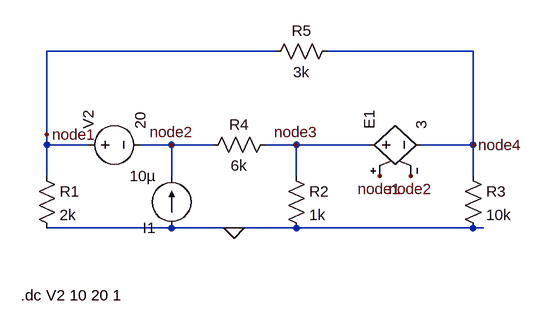
[diagram p0: schematic 2.asc]
2.asc, the LTspice schematic file:
Version 4
SHEET 1 880 680
WIRE 208 32 -144 32
WIRE 512 32 288 32
WIRE -144 160 -144 32
WIRE -144 176 -144 160
WIRE -80 176 -144 176
WIRE 48 176 0 176
WIRE 112 176 48 176
WIRE 240 176 192 176
WIRE 352 176 240 176
WIRE 512 176 512 32
WIRE 512 176 432 176
WIRE -144 224 -144 176
WIRE 48 224 48 176
WIRE 240 224 240 176
WIRE 512 224 512 176
WIRE 48 304 -144 304
WIRE 144 304 48 304
WIRE 240 304 144 304
WIRE 512 304 240 304
WIRE 528 304 512 304
FLAG 144 304 0
FLAG -144 160 node1
FLAG 48 176 node2
FLAG 240 176 node3
FLAG 512 176 node4
FLAG 368 224 node1
FLAG 416 224 node2
SYMBOL res -160 208 R0
SYMATTR InstName R1
SYMATTR Value 2k
SYMBOL res 224 208 R0
SYMATTR InstName R2
SYMATTR Value 1k
SYMBOL res 496 208 R0
SYMATTR InstName R3
SYMATTR Value 10k
SYMBOL res 208 160 R90
WINDOW 0 0 56 VBottom 2
WINDOW 3 32 56 VTop 2
SYMATTR InstName R4
SYMATTR Value 6k
SYMBOL res 304 16 R90
WINDOW 0 0 56 VBottom 2
WINDOW 3 32 56 VTop 2
SYMATTR InstName R5
SYMATTR Value 3k
SYMBOL current 48 304 R180
WINDOW 123 0 0 Left 0
WINDOW 39 0 0 Left 0
SYMATTR InstName I1
SYMATTR Value 10µ
SYMBOL voltage -96 176 R270
WINDOW 123 0 0 Left 0
WINDOW 39 0 0 Left 0
SYMATTR InstName V2
SYMATTR Value 20
SYMBOL e 336 176 R270
SYMATTR InstName E1
SYMATTR Value 3
TEXT -184 408 Left 2 !.dc V2 10 20 1

The netlist it stands for:
* 2.asc
R1 node1 0 2k
R2 node3 0 1k
R3 node4 0 10k
R4 node3 node2 6k
R5 node4 node1 3k
I1 0 node2 10µ
V2 node1 node2 20
E1 node3 node4 node1 node2 3
.dc V2 10 20 1
.backanno
.end